# Altium schematic sheet COM.SchDoc (part 1 of 3)
size A4; SheetNumber: 5; SheetTotal: 7
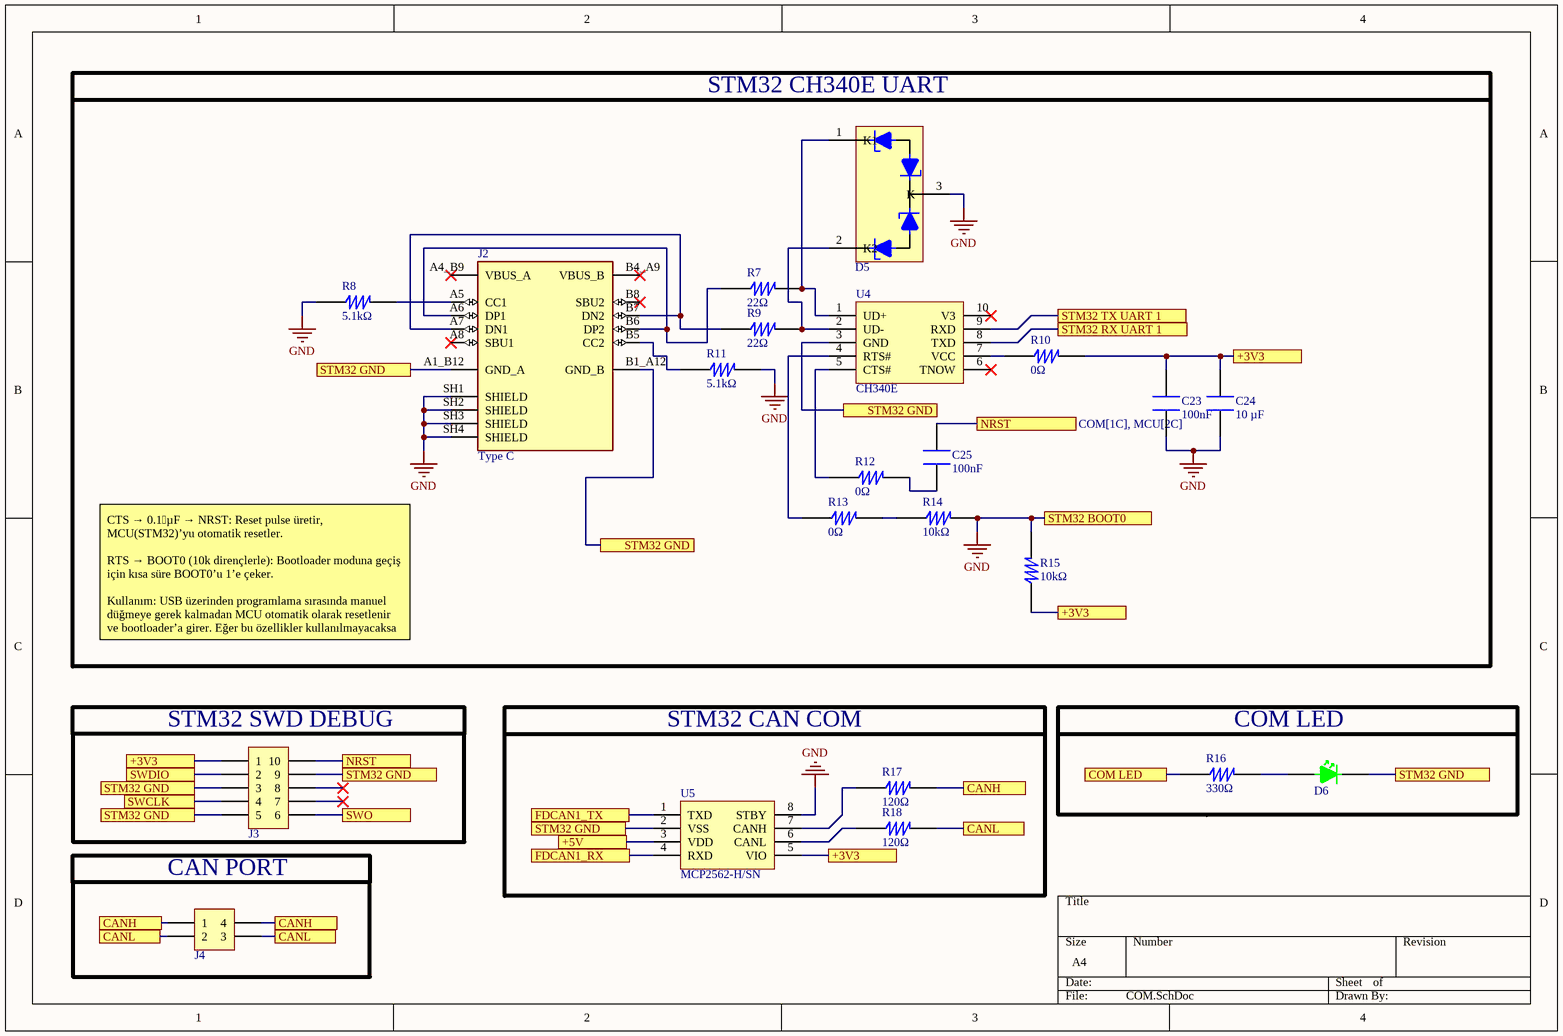
[diagram p0: COM.SchDoc]

## Parts
C23  value 100nF  [CAP CER 0603]  (hidden comment: KGM15AR70J104JT)
C24  Capacitance: 10 µF  [CAP CER 0805]  (hidden comment: 0805W106K500CC)
C25  value 100nF  [CAP CER 0603]  (hidden comment: KGM15AR70J104JT)
D5  PESD5V0S2BT,215  [SOT-23]  (value not drawn)
D6  LTST-C190GKT  [LED 0603]  (value not drawn)
J2  Model: Type C  [TYPE-C]  (hidden comment: GSB1C41110SSHR)
J3  TD-105-T-A  [TD-105-T-A]  (value not drawn)
J4  TD-102-T-A  [TD-102-T-A]  (value not drawn)
R7  value 22Ω  [RES 0603]  (hidden comment: RMCF0603FT22R0)
R8  value 5.1kΩ  [RES 0603]  (hidden comment: RC0603FR-075K1L)
R9  value 22Ω  [RES 0603]  (hidden comment: RMCF0603FT22R0)
R10  value 0Ω  [RES 0603]  (hidden comment: RMCF0603ZT0R00)
R11  value 5.1kΩ  [RES 0603]  (hidden comment: RC0603FR-075K1L)
R12  value 0Ω  [RES 0603]  (hidden comment: RMCF0603ZT0R00)
R13  value 0Ω  [RES 0603]  (hidden comment: RMCF0603ZT0R00)
R14  value 10kΩ  [RES 0603]  (hidden comment: RMCF0603FT10K0)
R15  value 10kΩ  [RES 0603]  (hidden comment: RMCF0603FT10K0)
R16  value 330Ω  [RES 0603]  (hidden comment: CRG0603F330R)
R17  value 120Ω  [RES 0603]  (hidden comment: ERA-3AEB121V)
R18  value 120Ω  [RES 0603]  (hidden comment: ERA-3AEB121V)
U4  USB TO SERIAL IC - CH340E (10 PA  [10-MSOP]  (value not drawn)
U5  MCP2562-H/SN  [8-SOIC]

## Blocks framed on the sheet
STM32 CH340E UART: C23-C25 D5 J2 R7-R15 U4
STM32 SWD DEBUG: J3
STM32 CAN COM: R17 R18 U5
CAN PORT: J4

## Ports
+3V3 (see COM[1C], COM[3C], COM[3D], ESP32 and Flash[2A], ESP32 and Flash[3A], MCU[2A], MCU[2B], MCU[3A], MCU[3B], MCU[3D], Power[3B], Power[4A]), +3V3 (see COM[1C], COM[3C], COM[4B], ESP32 and Flash[2A], ESP32 and Flash[3A], MCU[2A], MCU[2B], MCU[3A], MCU[3B], MCU[3D], Power[3B], Power[4A]), +3V3 (see COM[1C], COM[3D], COM[4B], ESP32 and Flash[2A], ESP32 and Flash[3A], MCU[2A], MCU[2B], MCU[3A], MCU[3B], MCU[3D], Power[3B], Power[4A]), +3V3 (see COM[3C], COM[3D], COM[4B], ESP32 and Flash[2A], ESP32 and Flash[3A], MCU[2A], MCU[2B], MCU[3A], MCU[3B], MCU[3D], Power[3B], Power[4A]), +5V (see Power[2A], Power[3A]), CANH (see COM[1D]), CANH (see COM[1D], COM[3D]), CANL (see COM[1D]), CANL (see COM[1D], COM[3D]), COM LED (see MCU[3B]), FDCAN1_RX (see MCU[3B]), FDCAN1_TX (see MCU[3B]), NRST (see COM[1C], MCU[2C]), NRST (see COM[3B], MCU[2C]), STM32 BOOT0, STM32 GND (see COM[1B], COM[1D], COM[2C], COM[2D], COM[3B], COM[4D], ESP32 and Flash[2C], MCU[3A], MCU[3D], MCU[4B], Power[1C], Power[2B]), STM32 GND (see COM[1B], COM[1D], COM[2C], COM[2D], COM[3B], ESP32 and Flash[2C], MCU[3A], MCU[3D], MCU[4B], Power[1C], Power[2B]), STM32 GND (see COM[1B], COM[1D], COM[2C], COM[2D], COM[4D], ESP32 and Flash[2C], MCU[3A], MCU[3D], MCU[4B], Power[1C], Power[2B]), STM32 GND (see COM[1B], COM[1D], COM[2C], COM[3B], COM[4D], ESP32 and Flash[2C], MCU[3A], MCU[3D], MCU[4B], Power[1C], Power[2B]), STM32 GND (see COM[1B], COM[1D], COM[2D], COM[3B], COM[4D], ESP32 and Flash[2C], MCU[3A], MCU[3D], MCU[4B], Power[1C], Power[2B]), STM32 GND (see COM[1D], COM[2C], COM[2D], COM[3B], COM[4D], ESP32 and Flash[2C], MCU[3A], MCU[3D], MCU[4B], Power[1C], Power[2B]), STM32 RX UART 1 (see MCU[3B]), STM32 TX UART 1 (see MCU[3B]), SWCLK (see MCU[3B]), SWDIO (see MCU[3B]), SWO (see MCU[3B])

## Nets
GND: C23.2 C24.2 D5.3(K) J2.SH1(SHIELD) J2.SH2(SHIELD) J2.SH3(SHIELD) J2.SH4(SHIELD) R8.1 R11.2 R14.2 R15.2 U5.8(STBY) ; port STM32 BOOT0
+3V3: C23.1 C24.1 J3.1 R10.2 R15.1 U5.5(VIO) ; port +3V3
+5V: U5.3(VDD) ; port +5V
CANH: J4.01(1) J4.04(4) R17.2 ; port CANH
CANL: J4.02(2) J4.03(3) R18.2 ; port CANL
COM LED: R16.1 ; port COM LED
FDCAN1_RX: U5.4(RXD) ; port FDCAN1_RX
FDCAN1_TX: U5.1(TXD) ; port FDCAN1_TX
NRST: C25.1 J3.10 ; port NRST
STM32 GND: D6.2 J2.A1_B12(GND_A) J2.B1_A12(GND_B) J3.3 J3.5 J3.9 U4.3(GND) U5.2(VSS) ; port STM32 GND
STM32 RX UART 1: U4.8(TXD) ; port STM32 RX UART 1
STM32 TX UART 1: U4.9(RXD) ; port STM32 TX UART 1
SWCLK: J3.4 ; port SWCLK
SWDIO: J3.2 ; port SWDIO
SWO: J3.6 ; port SWO
NetC25_2: C25.2 R12.2
NetD5_1: D5.1(K1) R7.2 U4.1(UD+)
NetD5_2: D5.2(K2) R9.2 U4.2(UD-)
NetD6_1: D6.1 R16.2
NetJ2_A5: J2.A5(CC1) R8.2
NetJ2_A6: J2.A6(DP1) J2.B6(DP2) R7.1
NetJ2_A7: J2.A7(DN1) J2.B7(DN2) R9.1
NetJ2_B5: J2.B5(CC2) R11.1
NetR10_1: R10.1 U4.7(VCC)
NetR12_1: R12.1 U4.5(CTS#)
NetR13_1: R13.1 U4.4(RTS#)
NetR13_2: R13.2 R14.1
NetR17_1: R17.1 U5.7(CANH)
NetR18_1: R18.1 U5.6(CANL)

Not connected (* = marked no-connect by the designer): J2 A4_B9(VBUS_A)* A8(SBU1)* B4_A9(VBUS_B)* B8(SBU2)*; J3 7* 8*; U4 6(TNOW)* 10(V3)*

## Notes on the sheet
- CTS → 0.1 µF → NRST: Reset pulse üretir, MCU(STM32)’yu otomatik resetler.
  RTS → BOOT0 (10k dirençlerle): Bootloader moduna geçiş için kısa süre BOOT0’u 1’e çeker.
  Kullanım: USB üzerinden programlama sırasında manuel düğmeye gerek kalmadan MCU otomatik olarak resetlenir ve bootloader’a girer. Eğer bu özellikler kullanılmayacaksa pcB üzerindeki jumperlar sökülebilir
- COM LED